# Altium schematic sheet Controller.SchDoc
size A; SheetNumber: 1
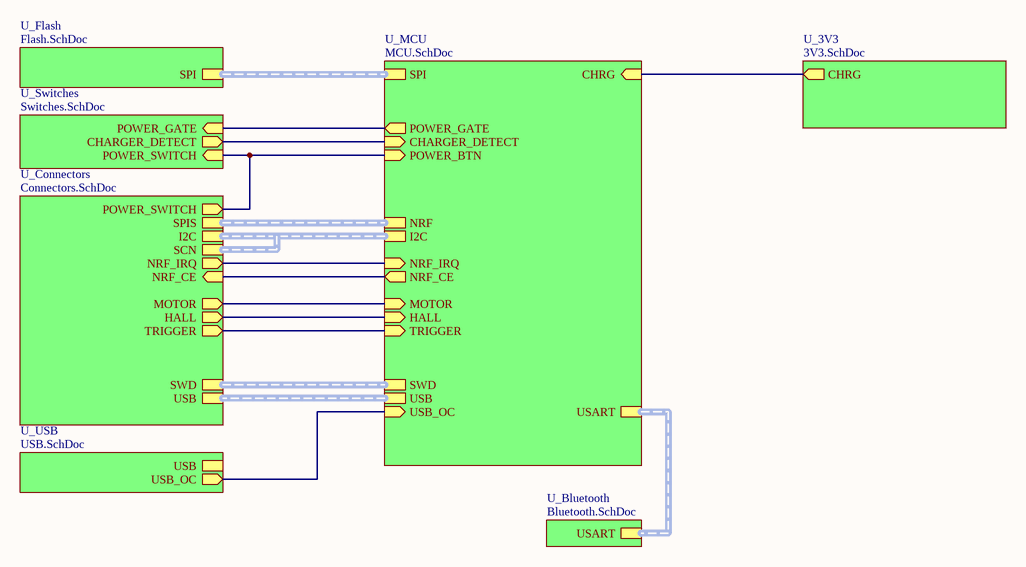
[diagram p0: Controller.SchDoc]

## Sub-sheets
U_3V3 = 3V3.SchDoc: CHRG (out)
U_Bluetooth = Bluetooth.SchDoc: USART (harness USART2)
U_Connectors = Connectors.SchDoc: POWER_SWITCH (out), SWD (harness SWD), HALL (out), USB, SPIS (harness SPI), I2C (harness I2C), SCN (harness I2C), MOTOR (out), NRF_IRQ (out), NRF_CE (in), TRIGGER (out)
U_Flash = Flash.SchDoc: SPI (harness SPI)
U_MCU = MCU.SchDoc: POWER_BTN (in), POWER_GATE (out), USB (harness USB), I2C (harness I2C), USART (harness USART2), SPI, SWD (harness SWD), USB_OC (in), CHARGER_DETECT (in), NRF, HALL (in), MOTOR (in), NRF_IRQ (in), NRF_CE (out), TRIGGER (in), CHRG (in)
U_Switches = Switches.SchDoc: POWER_GATE (in), POWER_SWITCH (in), CHARGER_DETECT (out)
U_USB = USB.SchDoc: USB_OC (out), USB (harness USB)

## Nets
(unnamed): sheet U_3V3/CHRG, sheet U_MCU/CHRG
(unnamed): sheet U_MCU/POWER_BTN, sheet U_Switches/POWER_SWITCH, sheet U_Connectors/POWER_SWITCH
(unnamed): sheet U_MCU/POWER_GATE, sheet U_Switches/POWER_GATE
(unnamed): sheet U_MCU/USB_OC, sheet U_USB/USB_OC
(unnamed): sheet U_MCU/CHARGER_DETECT, sheet U_Switches/CHARGER_DETECT
(unnamed): sheet U_MCU/HALL, sheet U_Connectors/HALL
(unnamed): sheet U_MCU/MOTOR, sheet U_Connectors/MOTOR
(unnamed): sheet U_MCU/NRF_IRQ, sheet U_Connectors/NRF_IRQ
(unnamed): sheet U_MCU/NRF_CE, sheet U_Connectors/NRF_CE
(unnamed): sheet U_MCU/TRIGGER, sheet U_Connectors/TRIGGER

## Buses and harness runs
harness sheet U_Bluetooth/USART = sheet U_MCU/USART
harness sheet U_Connectors/I2C = sheet U_Connectors/SCN = sheet U_MCU/I2C
harness sheet U_Connectors/SPIS = sheet U_MCU/NRF
harness sheet U_Connectors/SWD = sheet U_MCU/SWD
harness sheet U_Connectors/USB = sheet U_MCU/USB
harness sheet U_Flash/SPI = sheet U_MCU/SPI